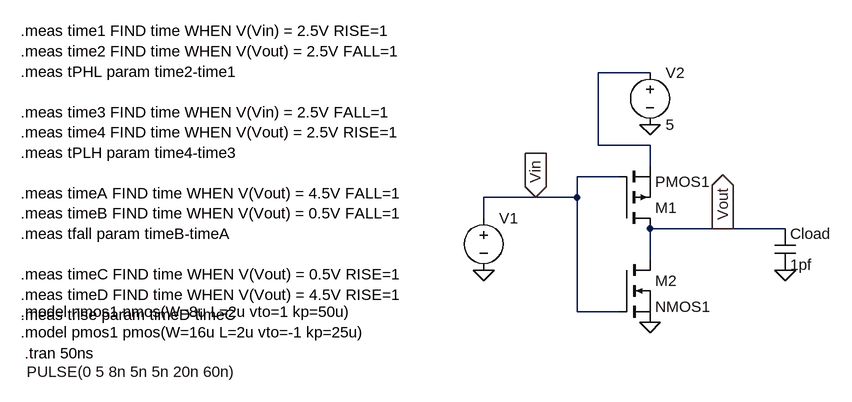
[diagram p0: schematic CMOS_INV.asc]
CMOS_INV.asc, the LTspice schematic file:
Version 4
SHEET 1 880 680
WIRE 192 -112 112 -112
WIRE 112 0 112 -112
WIRE 192 0 112 0
WIRE 192 32 192 0
WIRE 144 48 80 48
WIRE 16 80 -64 80
WIRE 80 80 80 48
WIRE 80 80 16 80
WIRE -64 112 -64 80
WIRE 304 128 192 128
WIRE 400 128 304 128
WIRE 192 176 192 128
WIRE 80 256 80 80
WIRE 144 256 80 256
FLAG 192 -32 0
FLAG -64 192 0
FLAG 192 272 0
FLAG 400 192 0
FLAG 16 80 Vin
IOPIN 16 80 In
FLAG 304 128 Vout
IOPIN 304 128 Out
SYMBOL nmos 144 176 R0
SYMATTR InstName M2
SYMATTR Value NMOS1
SYMBOL voltage -64 96 R0
WINDOW 3 -703 252 Left 2
WINDOW 123 0 0 Left 0
WINDOW 39 0 0 Left 0
SYMATTR InstName V1
SYMATTR Value PULSE(0 5 8n 5n 5n 20n 60n)
SYMBOL voltage 192 -128 R0
WINDOW 123 0 0 Left 0
WINDOW 39 0 0 Left 0
SYMATTR InstName V2
SYMATTR Value 5
SYMBOL cap 384 128 R0
SYMATTR InstName Cload
SYMATTR Value 1pf
SYMBOL pmos 144 128 M180
SYMATTR InstName M1
SYMATTR Value PMOS1
TEXT -776 256 Left 2 !.model nmos1 nmos(W=8u L=2u vto=1 kp=50u)\n.model pmos1 pmos(W=16u L=2u vto=-1 kp=25u)
TEXT -770 320 Left 2 !.tran 50ns
TEXT -776 -176 Left 2 !.meas time1 FIND time WHEN V(Vin) = 2.5V RISE=1\n.meas time2 FIND time WHEN V(Vout) = 2.5V FALL=1\n.meas tPHL param time2-time1\n \n.meas time3 FIND time WHEN V(Vin) = 2.5V FALL=1\n.meas time4 FIND time WHEN V(Vout) = 2.5V RISE=1\n.meas tPLH param time4-time3\n \n.meas timeA FIND time WHEN V(Vout) = 4.5V FALL=1\n.meas timeB FIND time WHEN V(Vout) = 0.5V FALL=1\n.meas tfall param timeB-timeA\n \n.meas timeC FIND time WHEN V(Vout) = 0.5V RISE=1\n.meas timeD FIND time WHEN V(Vout) = 4.5V RISE=1\n.meas trise param timeD-timeC

The netlist it stands for:
* CMOS_INV.asc
M2 Vout Vin 0 0 NMOS1
V1 Vin 0 PULSE(0 5 8n 5n 5n 20n 60n)
V2 N001 0 5
Cload Vout 0 1pf
M1 Vout Vin N001 N001 PMOS1
.model NMOS NMOS
.model PMOS PMOS
.lib standard.mos
.model nmos1 nmos(W=8u L=2u vto=1 kp=50u)
.model pmos1 pmos(W=16u L=2u vto=-1 kp=25u)
.tran 50ns
.meas time1 FIND time WHEN V(Vin) = 2.5V RISE=1
.meas time2 FIND time WHEN V(Vout) = 2.5V FALL=1
.meas tPHL param time2-time1
.meas time3 FIND time WHEN V(Vin) = 2.5V FALL=1
.meas time4 FIND time WHEN V(Vout) = 2.5V RISE=1
.meas tPLH param time4-time3
.meas timeA FIND time WHEN V(Vout) = 4.5V FALL=1
.meas timeB FIND time WHEN V(Vout) = 0.5V FALL=1
.meas tfall param timeB-timeA
.meas timeC FIND time WHEN V(Vout) = 0.5V RISE=1
.meas timeD FIND time WHEN V(Vout) = 4.5V RISE=1
.meas trise param timeD-timeC
.backanno
.end